# Altium schematic sheet HX711_2.SchDoc
size A4; SheetNumber: 4; SheetTotal: 5
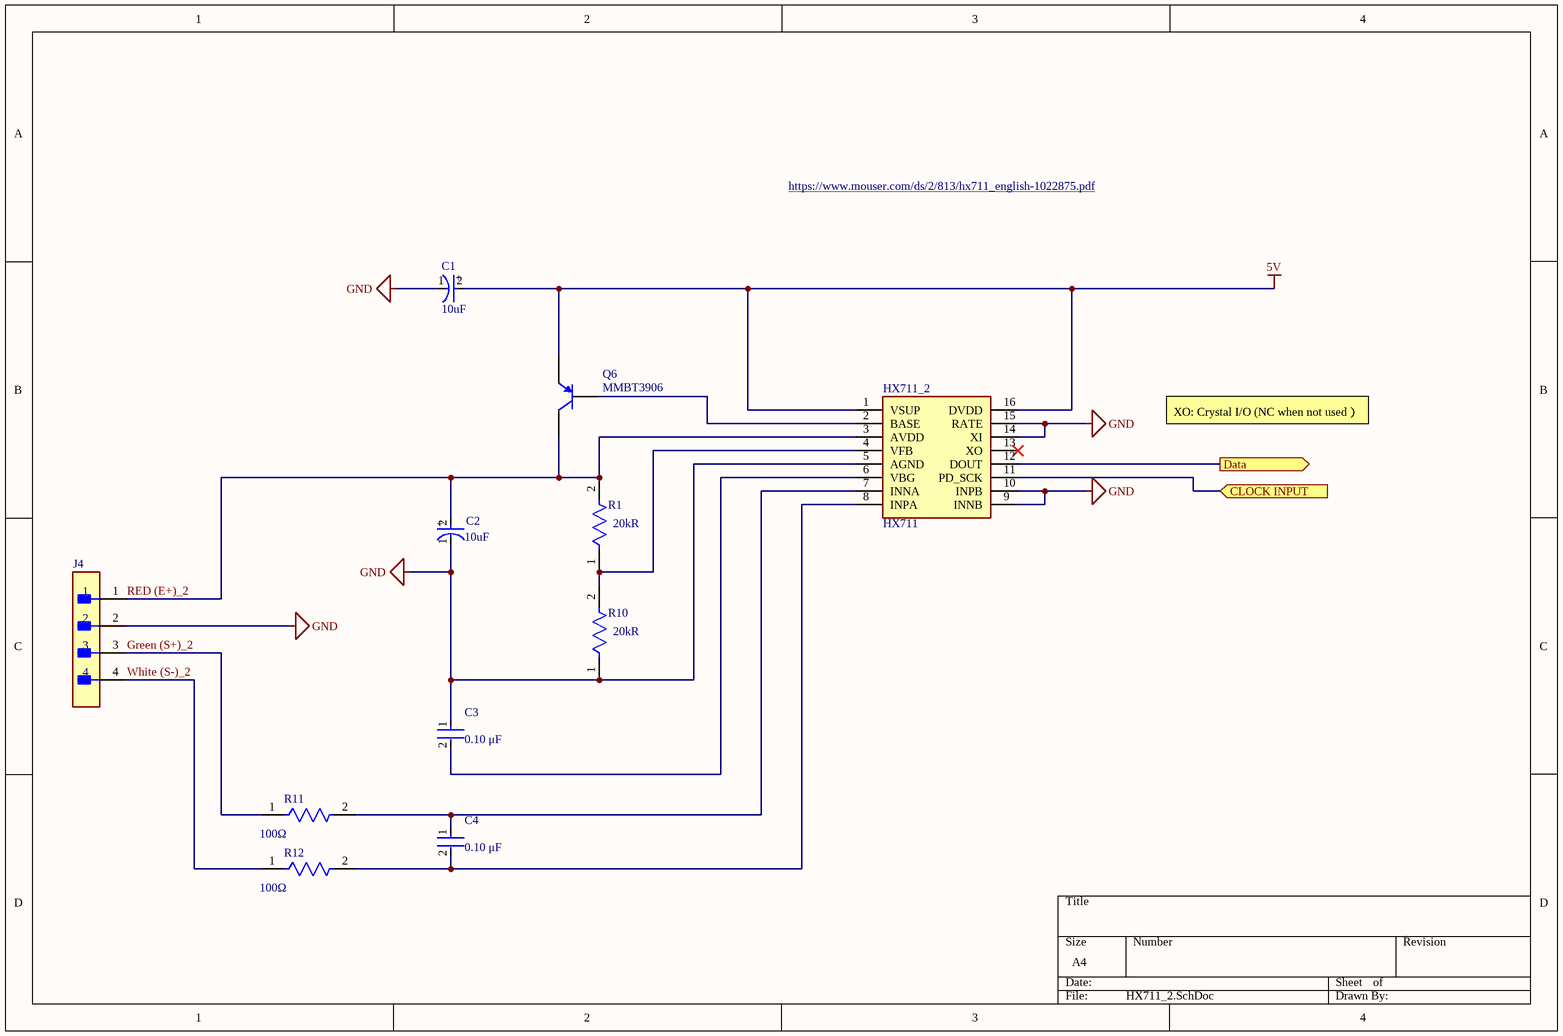
[diagram p0: HX711_2.SchDoc]

## Parts
C1  Capacitance: 10uF  [FP-EDK9B-MFG]  (hidden comment: EDK106M035A9BAA)
C2  Capacitance: 10uF  [FP-EDK9B-MFG]  (hidden comment: EDK106M035A9BAA)
C3  value 0.10 μF  [FP-C0603C-CF-MFG]  (hidden comment: C0603C104K3RAC7411)
C4  value 0.10 μF  [FP-C0603C-CF-MFG]  (hidden comment: C0603C104K3RAC7411)
HX711_2  HX711  [SOIC127P600X160-16N]
J4  TSW-104-23-T-S  [FP-TSW-104-23-T-S-MFG]  (value not drawn)
Q6  MMBT3906  [FAIR-SOT23-3_V]
R1  Resistance: 20kR  [FP-CRCW0603-HPe3-MFG]  (hidden comment: CRCW060320K0FKEAHP)
R10  Resistance: 20kR  [FP-CRCW0603-HPe3-MFG]  (hidden comment: CRCW060320K0FKEAHP)
R11  value 100Ω  [FP-RT0603-MFG]  (hidden comment: RT0603FRE07100RL)
R12  value 100Ω  [FP-RT0603-MFG]  (hidden comment: RT0603FRE07100RL)

## Ports
CLOCK INPUT (in), Data (out)

## Nets
5V: C1.2(A) HX711_2.1(VSUP) HX711_2.16(DVDD) Q6.2(E)
GND: C1.1(C) C2.1(C) C3.1 HX711_2.5(AGND) HX711_2.9(INNB) HX711_2.10(INPB) HX711_2.14(XI) HX711_2.15(RATE) J4.2 R10.1
CLOCK INPUT: HX711_2.11(PD_SCK) ; port CLOCK INPUT
Data: HX711_2.12(DOUT) ; port Data
Green (S+)_2: J4.3 R11.1
RED (E+)_2: C2.2(A) HX711_2.3(AVDD) J4.1 Q6.3(C) R1.2
White (S-)_2: J4.4 R12.1
NetC3_2: C3.2 HX711_2.6(VBG)
NetC4_1: C4.1 HX711_2.7(INNA) R11.2
NetC4_2: C4.2 HX711_2.8(INPA) R12.2
NetHX711_2_2: HX711_2.2(BASE) Q6.1(B)
NetHX711_2_4: HX711_2.4(VFB) R1.1 R10.2

Not connected (* = marked no-connect by the designer): HX711_2 13(XO)*

## Notes on the sheet
- https://www.mouser.com/ds/2/813/hx711_english-1022875.pdf
- XO: Crystal I/O (NC when not used）
- (in symbol CMP-03015-000003-1) +

## Library data of the parts
C1 C2 = CMP-03015-000003-1: CAP ALUM 10UF 20% 35V SMD; Manufacturer: Kemet; Dissipation Factor: 16%; Material: Aluminum; Leakage Current: 3.5uA; Ripple Current: 24mA; Life: 2000Hours; Device Class L2: Capacitors; Device Class L1: Passive Components; Device Class L3: Aluminum Electrolytic Capacitors; RoHS: TRUE; Digikey Description: CAP ALUM 10UF 20% 35V SMD; ComponentLink2URL: https://content.kemet.com/datasheets/KEM_A4001_EDK.pdf; Temperature: -40°C to +85°C; Category: Cap; Voltage Rating: 35V; Value: 10uF; Temperature Range Low: -40°C; Lead Free: Yes; Octopart: https://octopart.com/edk106m035a9baa-kemet-26722193; Footprint Url: http://www.kemet.com/Lists/FileStore/smd_radial_ordering_codes_tech.pdf; Manufacturer Part Number: EDK106M035A9BAA; Height: 5.65mm; Package: EDK9B; Tolerance: 20%; Temperature Range High: +85°C; Automotive: No; ComponentLink2Description: Datasheet
C3 C4 = CMP-2006-02291-2: CAP CER 0.1UF 25V X7R 0603; Manufacturer: KEMET; Material: Ceramic; Temperature Coefficient: 30ppm/°C; Automotive Grade: Grade 1; Tolerance: 0.1; Device Class L2: Capacitors; ComponentLink2URL: https://api.kemet.com/component-edge/download/datasheet/C0603C100J5GACAUTO.pdf; Device Class L3: Ceramic Capacitors; Capacitance: 0.10 μF; Octopart: https://octopart.com/c0603c104k3rac7411-kemet-9138804; Lead Free: Yes; Automotive: Yes; ComponentLink2Description: Datasheet; Temperature Characteristic: X7R; Height: 0.87mm; Temperature: -55°C to +125°C; Temperature Range High: +125°C; Temperature Range Low: -55°C; Category: Cap; Package: C0603C-CF; Device Class L1: Passive Components; RoHS: TRUE; Digikey Description: CAP CER 0.1UF 25V X7R 0603; Voltage Rating: 25 V; Mouser Description: Multilayer Ceramic Capacitors MLCC - SMD/SMT 25volts 0.1uF X7R 10%; Manufacturer Part Number: C0603C104K3RAC7411
HX711_2 = HX711: Integrated Circuit; Manufacturer_Name: AVIA; Datasheet Link: https://cdn.sparkfun.com/datasheets/Sensors/ForceFlex/hx711_english.pdf; Height: 1.6mm; Manufacturer_Part_Number: HX711
J4 = CMP-02766-001388-1: CONN HEADER VERT 4POS 2.54MM; Number of Contacts: 4; Gender: Male; Connector Type: Male Pin; Max Voltage Rating (AC): 550V; Max Current Rating: 7.6A; Radiation Hardening: No; Lead Free: Lead Free; RoHS Compliant: Yes; Contact Material: Bronze; Number of Positions: 4; Housing Color: Black; Min Operating Temperature: -55°C; Mount: Through Hole; Number of Rows: 1; Orientation: Straight; Contact Mating Length: 0.23inch; Contact Type: Male Pin; REACH SVHC: No SVHC; Max Operating Temperature: 105°C; Color: Black; Pitch: 2.54mm; Length: 10.16mm; Series: TSW; Packaging: Bulk; Contact Plating: Tin; Package Quantity: 1; Termination: Solder; Housing Material: Polyester; Width: 2.54mm; Depth: 2.54mm
Q6 = CMP-1670-00011-1: PNP General-Purpose Amplifier, 40 V, 0.2 A, -55 to 150 degC, 3-Pin SOT23, RoHS, Tape and Reel; Tolerance: 20%; Capacitance: 1 uF; Voltage Rating (DC): 50 V; Case\Package: Radial; Radiation Hardening: No; REACH SVHC: No SVHC; Height: 11 mm; Length: 12 mm; Pins: 2; Min Operating Temperature: -55 degC; ComponentLink1Description: Manufacturer URL; Mount: Through Hole; ComponentLink2URL: https://www.fairchildsemi.com/datasheets/MM/MMBT3906.pdf; ComponentLink3Description: Package Specification; Package Quantity: 200; Diameter: 5 mm; Width: 0 inch; Voltage Rating: 50 V; ComponentLink2Description: Datasheet; PackageDescription: 3-Pin Small Outline Transistor, Body 2.92 x 1.325 mm, Pitch 0.95 mm; DatasheetVersion: Rev. 1.2.2, 04/2014; Max Operating Temperature: 105 degC; RoHSCompliant: true; PackageReference: SOT23-3; Lead Pitch: 2 mm; Packaging: Bulk; ComponentLink3URL: http://www.fairchildsemi.com/dwg/MA/MA03D.pdf; ComponentLink1URL: https://www.fairchildsemi.com/
R1 R10 = CMP-02407-007301-1: RES Thick Film, 20kΩ, 1%, 0.33W, 100ppm/°C, 0603; Voltage Rating: 75V; Max Power Dissipation: 250mW; Weight: 7.1E-05oz; Radiation Hardening: No; Length: 1.6mm; Case/Package: 0603; Width: 0.033inch; Mount: Surface Mount; Height: 0.45mm; Composition: Thick Film; Depth: 0.85mm; Min Operating Temperature: -55°C; Contact Plating: Tin; Termination: SMD/SMT; Case Code (Metric): 1608; Tolerance: 1%; Number of Terminations: 2; Max Operating Temperature: 155°C; Case Code (Imperial): 0603; Power Rating: 250mW; Package Quantity: 10; Temperature Coefficient: 100ppm/°C; Lead Free: Lead Free; Features: Automotive AEC-Q200; Packaging: Tape and Reel
R11 R12 = CMP-03412-022806-1: RES SMD 100 OHM 1% 1/10W 0603; Manufacturer: Yageo; Power Rating: 0.1W; Voltage Rating: 75V; Temperature Coefficient: 50 ppm/°C; Tolerance: 0.01; Manufacturer Part Number: RT0603FRE07100RL; Mouser Description: Thin Film Resistors - SMD 1/10W 100 ohm 1% 50ppm; Ipc Land Pattern Name: RESC16080X45; Height: 0.55mm; Category: Res; Temperature Range Low: -55°C; Lead Free: Yes; Automotive: No; Device Class L3: Chip SMD Resistors; ComponentLink2Description: Datasheet; Device Class L2: Resistors; RoHS: TRUE; Footprint Url: http://www.yageo.com/exep/pages/download/literatures/PYu-R_Mount_10.pdf; Digikey Description: RES SMD 100 OHM 1% 1/10W 0603; Temperature Range High: +155°C; Resistance: 100Ω; Package: RT0603; Device Class L1: Passive Components; Series: RT; Temperature: -55°C to +155°C; Octopart: https://octopart.com/rt0603fre07100rl-yageo-39792638; Composition: Thin Film; ComponentLink2URL: http://www.yageo.com/documents/recent/PYu-RT_1-to-0.01_RoHS_L_9.pdf